# Altium schematic sheet fans.SchDoc: Fan
size Letter; CheckedBy: J. Brinton; CompanyName: Signal Laboratories, Inc.; DrawnBy: J. Brinton; Engineer: J. Brinton; Address1: 3479 Edison Way; Address2: Menlo Park CA 94025; Address3: +1 (877) 778-8435; Address4: siglabs.com; Revision: 3; SheetNumber: 40; SheetTotal: 49
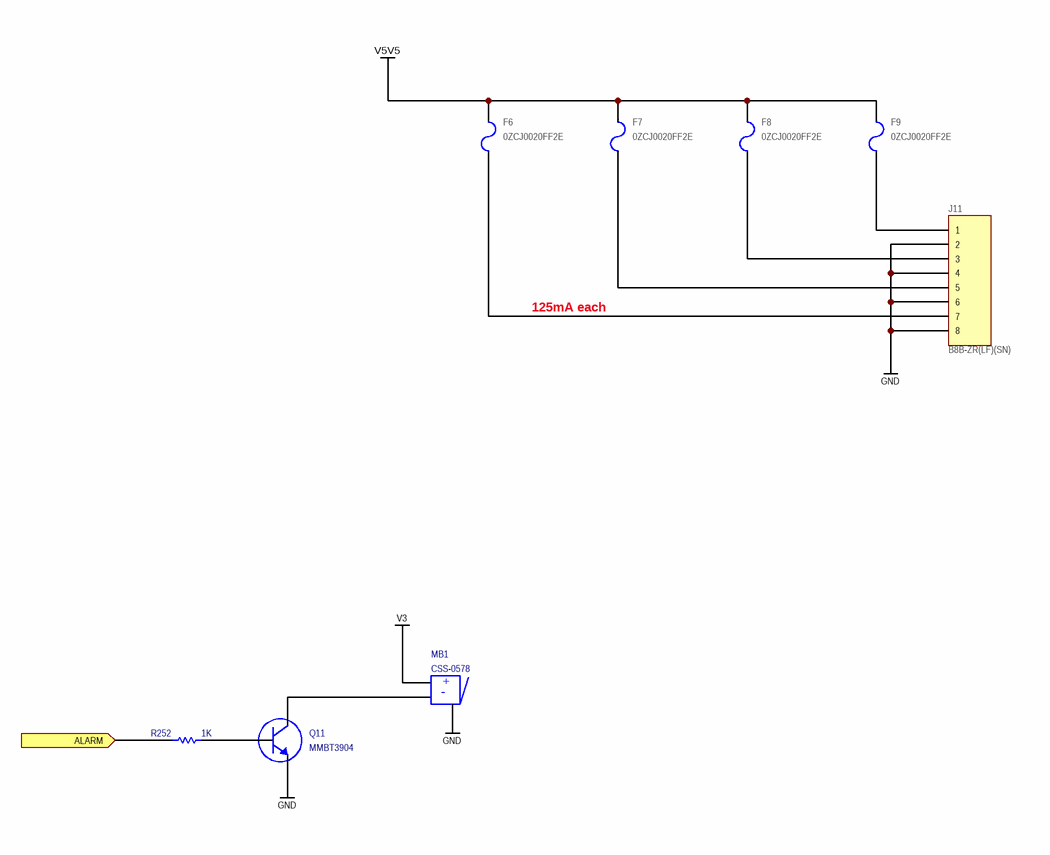
[diagram p0: fans.SchDoc]

## Parts
F6  0ZCJ0020FF2E  [1206]
F7  0ZCJ0020FF2E  [1206]
F8  0ZCJ0020FF2E  [1206]
F9  0ZCJ0020FF2E  [1206]
J11  B8B-ZR(LF)(SN)  [B8B-ZR]
MB1  CSS-0578  [CSS-0578]
Q11  MMBT3904  [SOT23]
R252  value 1K  [RESC1005X40N]  (hidden comment: RC0402FR-071KL)

## Ports
ALARM (in)

## Nets
GND: J11.2 J11.4 J11.6 J11.8 MB1.3(TAB) Q11.2(E)
V3: MB1.1(POS)
V5V5: F6.1 F7.1 F8.1 F9.1
ALARM: R252.2 ; port ALARM
NetF6_2: F6.2 J11.7
NetF7_2: F7.2 J11.5
NetF8_2: F8.2 J11.3
NetF9_2: F9.2 J11.1
NetMB1_2: MB1.2(NEG) Q11.3(C)
NetQ11_1: Q11.1(B) R252.1

## Notes on the sheet
- 125mA each
- Title
- Engineer
- Revision
- Drawn By
- Checked By
- Date
- Sheet
- of
- (in symbol CSS-0578) +; -

## Library data of the parts
F6-F9 = 0ZCJ0020FF2E: PTC Resettable Fuse, 0.2A, 30V, SMD 1206; Manufacturer: Bell Fuse; Manufacturer P/N: 0ZCJ0020FF2E; Package: 1206
J11 = Header 8: Through-hole Shrouded Header 8-Position; Manufacturer: JST; Manufacturer P/N: B8B-ZR(LF)(SN)
MB1 = CSS-0578: Magnetic Buzzer; Manufacturer: CUI, Inc.; Manufacturer P/N: CSS-0578
Q11 = 2N3904: NPN General Purpose Amplifier; Manufacturer: Fairchild Semiconductor; Manufacturer P/N: MMBT3904
R252 = RES 0402: Thick Film Resistor 1k ±1% 0402; Manufacturer: Yageo; Tr: -55:155; Package: 0402; Manufacturer P/N: RC0402FR-071KL; Tolerance: ±1%